# EAGLE design AntHab-Micro-12i (EAGLE 9.6.1)
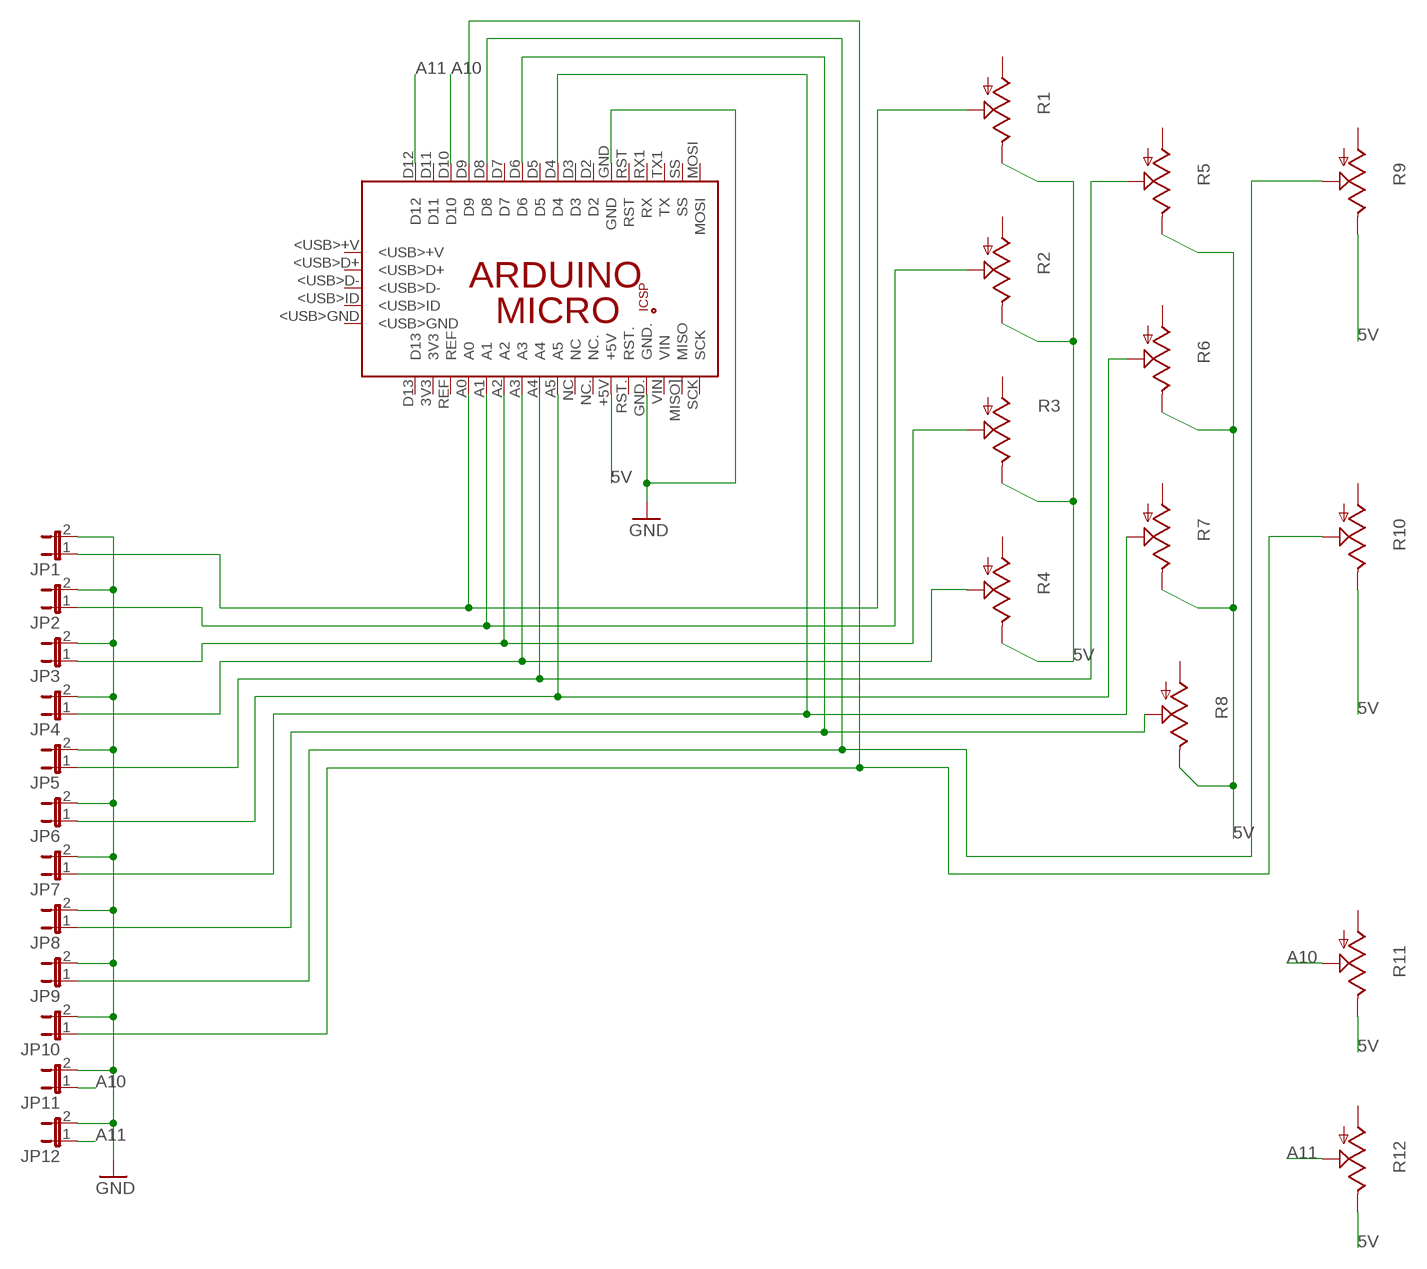
[diagram p0: schematic, sheet 1]

## Parts
JP1  JP1E  [JP1]
JP2  JP1E  [JP1]
JP3  JP1E  [JP1]
JP4  JP1E  [JP1]
JP5  JP1E  [JP1]
JP6  JP1E  [JP1]
JP7  JP1E  [JP1]
JP8  JP1E  [JP1]
JP9  JP1E  [JP1]
JP10  JP1E  [JP1]
JP11  JP1E  [JP1]
JP12  JP1E  [JP1]
PCB1  ARDUINO_MICRO  [ARDUINO_MICRO]
R1  TRIM_US-CT6  [CT6]
R2  TRIM_US-CT6  [CT6]
R3  TRIM_US-CT6  [CT6]
R4  TRIM_US-CT6  [CT6]
R5  TRIM_US-CT6  [CT6]
R6  TRIM_US-CT6  [CT6]
R7  TRIM_US-CT6  [CT6]
R8  TRIM_US-CT6  [CT6]
R9  TRIM_US-CT6  [CT6]
R10  TRIM_US-CT6  [CT6]
R11  TRIM_US-CT6  [CT6]
R12  TRIM_US-CT6  [CT6]

## Nets
5V: PCB1.+5V R1.E R2.E R3.E R4.E R5.E R6.E R7.E R8.E R9.E R10.E R11.E R12.E
A10: JP11.1 PCB1.D10 R11.S
A11: JP12.1 PCB1.D12 R12.S
GND: JP1.2 JP2.2 JP3.2 JP4.2 JP5.2 JP6.2 JP7.2 JP8.2 JP9.2 JP10.2 JP11.2 JP12.2 PCB1.GND PCB1.GND.
N$1: JP4.1 PCB1.A3 R4.S
N$2: JP5.1 PCB1.A4 R5.S
N$3: JP6.1 PCB1.A5 R6.S
N$4: JP7.1 PCB1.D4 R7.S
N$5: JP8.1 PCB1.D6 R8.S
N$6: JP9.1 PCB1.D8 R9.S
N$7: JP10.1 PCB1.D9 R10.S
N$9: JP1.1 PCB1.A0 R1.S
N$10: JP2.1 PCB1.A1 R2.S
N$11: JP3.1 PCB1.A2 R3.S
Unconnected: PCB1.3V3 PCB1.5V PCB1.<USB>+V PCB1.<USB>D+ PCB1.<USB>D- PCB1.<USB>GND PCB1.<USB>ID PCB1.D2 PCB1.D3 PCB1.D5 PCB1.D7 PCB1.D11 PCB1.D13 PCB1.GND_ PCB1.MISO. PCB1.MISO](MISO) PCB1.MOSI PCB1.MOSI. PCB1.NC PCB1.NC. PCB1.REF PCB1.RESET.. PCB1.RST PCB1.RST. PCB1.RX1(RX) PCB1.SCK PCB1.SCK. PCB1.SS PCB1.TX1(TX) PCB1.VIN R1.A R2.A R3.A R4.A R5.A R6.A R7.A R8.A R9.A R10.A R11.A R12.A

## Library data of the parts
JP1-JP12 = jumper:JP1E: JUMPER
PCB1 = E14_Arduino_revC:ARDUINO_MICRO: Device for representing an Arduino Micro board with a footprint in an EAGLE design. Created by Dave Young for Element14. More EAGLE documentation at: http://www.element14.com/community/community/knode/cadsoft_eagle
R1-R12 = pot:TRIM_US-: POTENTIOMETER

## Board
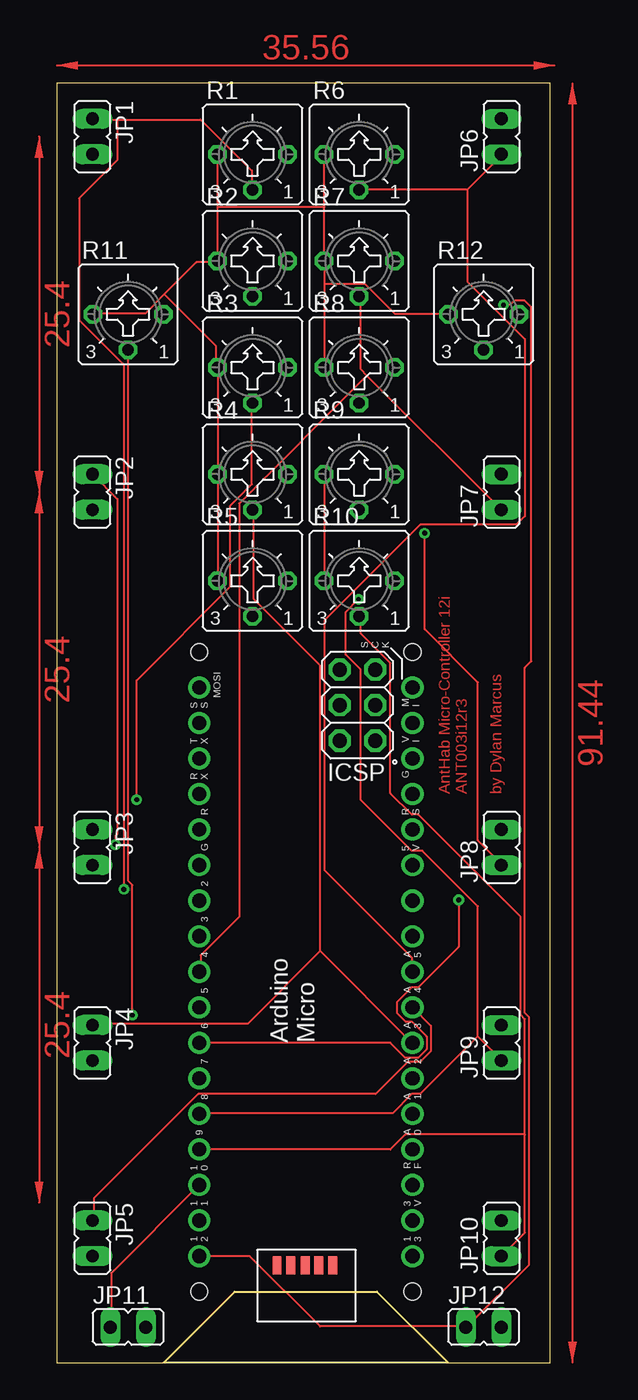
[diagram p1: board, top side]
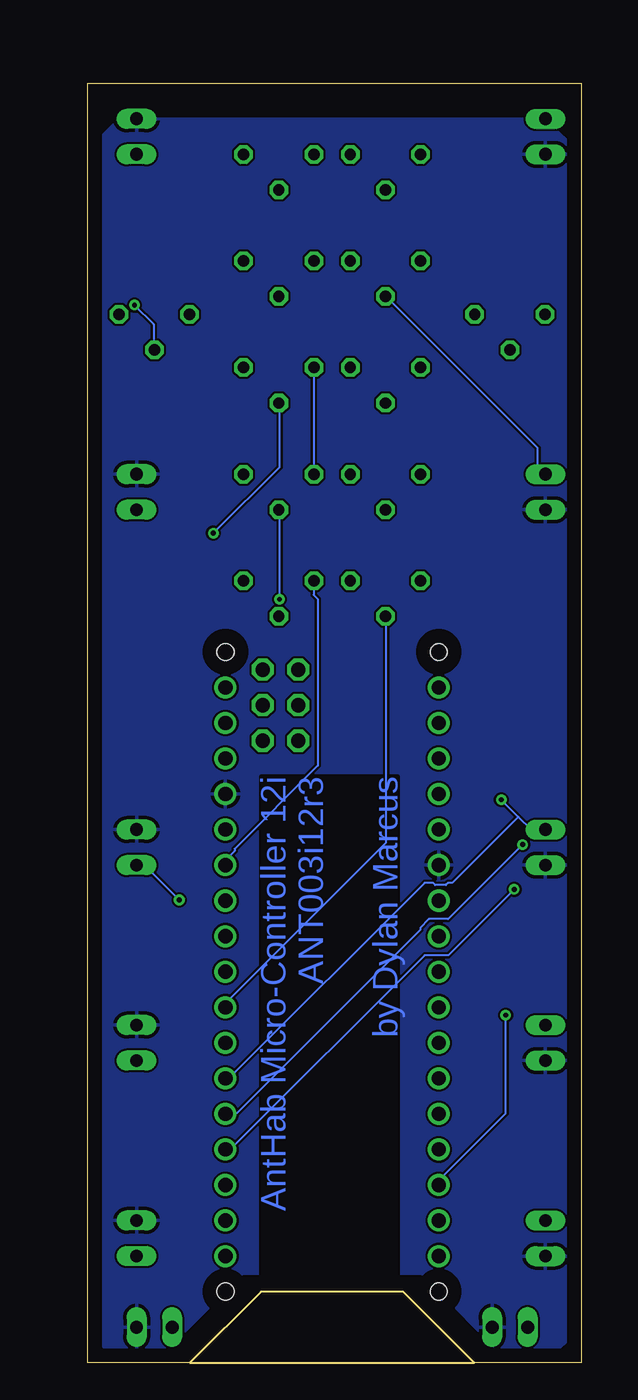
[diagram p2: board, bottom side, seen from below]

Size 35.23 x 91.43 mm. Coordinates in mm from the lower left corner, seen from the top.
Outline: 0,0 35.23,0 35.23,91.43 0,91.43 0,0
Copper layers (1*16): Top 0.035mm / dielectric 1.5mm / Bottom 0.035mm
Design rules "default": minimum track width 6mil, minimum drill 0.35mm, track to track 6mil, track to pad 6mil, pad to pad 6mil, via to via 6mil, smd to smd 6mil, copper to edge 40mil, drill to drill 6mil, minimum pad ring 10mil, minimum via ring 8mil, stop-mask expansion 4mil, vias tented up to drill 0mil, thermal gap 10mil
Milling: 4 lines

### Footprints (pad centres in the part's own frame; a part is rotated, then mirrored left to right if it is on the bottom)
JP1 = drill 0.914 long: 1 0,-1.27; 2 0,1.27
ARDUINO_MICRO = drill 1.016 pad 1.575: 3V3 6.35,1.27; +5V 31.75,1.27; A0 11.43,1.27; A1 13.97,1.27; A2 16.51,1.27; A3 19.05,1.27; A4 21.59,1.27; A5 24.13,1.27; D2 29.21,16.51; D3 26.67,16.51; D4 24.13,16.51; D5 21.59,16.51; D6 19.05,16.51; D7 16.51,16.51; D8 13.97,16.51; D9 11.43,16.51; D10 8.89,16.51; D11 6.35,16.51; D12 3.81,16.51; D13 3.81,1.27; GND 31.75,16.51; GND. 36.83,1.27; MISO] 41.91,1.27; MOSI 44.45,16.51; NC 26.67,1.27; NC. 29.21,1.27; REF 8.89,1.27; RST 34.29,16.51; RST. 34.29,1.27; RX1 36.83,16.51; SCK 44.45,1.27; SS 41.91,16.51; TX1 39.37,16.51; VIN 39.37,1.27 | drill 1.016 pad 1.575 octagon: 5V 40.64,6.477; GND_ 45.72,6.477; MISO. 40.64,3.937; MOSI. 43.18,6.477; RESET.. 45.72,3.937; SCK. 43.18,3.937 | smd 1.27 x 0.635: <USB>+V 3.15,10.947; <USB>D+ 3.15,9.957; <USB>D- 3.15,8.941; <USB>GND 3.15,6.96; <USB>ID 3.15,7.976 | hole 1.2: 1.27,1.27; 1.27,16.51; 46.99,16.51; 46.99,1.27
CT6 = drill 0.813 octagon: A 2.515,0; E -2.515,0; S 0,-2.54

### Placement (x,y rotation side)
JP1  2.54,87.63 180 top
JP2  2.54,62.23 180 top
JP3  2.54,36.83 180 top
JP4  2.54,22.86 180 top
JP5  2.54,8.89 180 top
JP6  31.75,87.63 0 top
JP7  31.75,62.23 0 top
JP8  31.75,36.83 0 top
JP9  31.75,22.86 0 top
JP10  31.75,8.89 0 top
JP11  5.08,2.54 270 top
JP12  30.48,2.54 270 top
PCB1  26.67,3.81 90 top
R1  13.97,86.36 0 top
R2  13.97,78.74 0 top
R3  13.97,71.12 0 top
R4  13.97,63.5 0 top
R5  13.97,55.88 0 top
R6  21.59,86.36 0 top
R7  21.59,78.74 0 top
R8  21.59,71.12 0 top
R9  21.59,63.5 0 top
R10  21.59,55.88 0 top
R11  5.08,74.93 0 top
R12  30.48,74.93 0 top

### Tracks (layer width: path | path; a pad name or v marks a point on that pad's centre or on a via)
5V
  Top 0.152: R10.E 19.1,55.93 19.1,63.4 R9.E | 19.1,77.11 19.1,78.64 R7.E 19.1,78.79 19.1,82.6 | 19.1,77.11 19.1,71.17 R8.E | 19.1,77.11 22,77.11 24.13,74.98 27.94,74.98 R12.E | 19.1,82.6 19.1,86.26 R6.E | R5.E 11.48,55.93 11.48,63.4 R4.E 11.48,63.55 11.48,71.02 R3.E 11.33,71.17 11.33,72.69 7.67,76.35 | 7.67,76.35 9.96,78.64 11.33,78.64 R2.E 11.48,78.79 11.48,82.6 | 7.67,76.35 6.3,74.98 2.64,74.98 R11.E | 11.48,82.6 11.48,86.26 R1.E | 11.48,82.6 19.1,82.6
  Bottom 0.152: PCB1.+5V 25.35,35.66 25.35,35.97 24.74,36.58 24.74,36.73 18.8,42.67 18.8,54.56 19.1,54.86 19.1,55.78 R10.E | R9.E 19.1,63.55 19.1,71.02 R8.E
A10  (via drill 0.35)
  Top 0.152: R11.S 5.08,34.44 5.38,34.14 v5.38,24.84 | PCB1.D10 3.86,6.4 3.86,2.59 JP11.1
  Bottom 0.152: v5.38,24.84 5.38,17.83 10.11,13.11 10.11,12.8 PCB1.D10
A11  (via drill 0.35)
  Top 0.152: v31.9,75.59 32.36,75.59 32.66,75.89 33.43,75.89 33.88,75.44 33.88,50.14 33.43,49.68 33.43,24.99 33.73,24.69 33.73,7.01 29.31,2.59 JP12.1 29.16,2.59 18.8,2.59 13.77,7.62 PCB1.D12
  Bottom 0.152: v31.9,75.59 30.53,74.22 30.53,72.39 R12.S
GND
  pour Bottom: 0,2.54 0,86.36 2.54,88.9 33.02,88.9 35.56,86.36 35.56,2.54 33.02,0 30.48,0 24.13,6.35 11.43,6.35 5.08,0 2.54,0
N$1
  Top 0.152: 18.8,29.41 18.8,49.84 14.07,54.56 14.07,60.96 R4.S | 18.8,29.41 25.35,22.86 PCB1.A3 | 18.8,29.41 13.61,24.23 2.64,24.23 JP4.1
N$2
  Top 0.152: PCB1.A4 26.72,24.08 26.72,22.25 25.96,21.49 25.04,21.49 22.76,19.2 10.11,19.2 2.64,11.73 2.64,10.21 JP5.1
  Bottom 0.152: R5.S 13.92,53.34 13.92,37.19 25.35,25.76 25.35,25.45 PCB1.A4
N$3
  Top 0.152: 29.31,83.82 R6.S | 29.31,83.82 31.75,86.26 JP6.1 | 29.31,83.82 29.31,77.27 33.43,73.15 33.43,60.5 32.82,59.89 25.96,59.89 19.1,53.03 19.1,35.2 25.35,28.96 25.35,28.04 PCB1.A5
N$4
  Top 0.152: JP7.1 22.15,70.56 | 22.15,70.56 21.69,71.02 21.69,76.2 R7.S | 22.15,70.56 13.01,61.42 13.01,31.85 10.26,29.11 10.26,28.04 PCB1.D4
N$5  (via drill 0.35)
  Top 0.152: v26.26,59.28 26.26,52.43 30.07,48.62 30.07,37.34 31.75,35.66 JP8.1 | PCB1.D6 23.83,22.86 24.89,21.79 25.81,21.79 26.42,22.4 26.42,23.32 25.35,24.38 24.89,24.38 24.28,24.99 24.28,25.76 25.35,26.82 25.81,26.82 28.7,29.72 v28.7,33.07
  Bottom 0.152: v26.26,59.28 21.54,64.01 21.54,68.58 R8.S | v28.7,33.07 31.14,35.51 31.75,35.51 JP8.1
N$6  (via drill 0.35)
  Top 0.152: v21.54,54.56 20.62,53.64 20.62,50.6 21.69,49.53 21.69,40.23 25.35,36.58 26.11,36.58 30.07,32.61 30.07,23.32 | 30.07,23.32 31.75,21.64 JP9.1 | 30.07,23.32 25.96,19.2 25.35,19.2 23.98,17.83 10.26,17.83 PCB1.D8
  Bottom 0.152: v21.54,54.56 21.54,60.96 R9.S
N$7
  Top 0.152: 33.43,16.31 33.43,9.3 JP10.1 | 33.43,16.31 33.43,24.54 33.12,24.84 33.12,31.85 25.81,39.17 25.35,39.17 23.83,40.69 23.83,49.99 21.69,52.12 21.69,53.34 R10.S | PCB1.D9 23.83,15.24 24.89,16.31 33.43,16.31
N$9  (via drill 0.35)
  Top 0.152: 4.32,88.85 2.64,88.85 JP1.1 | 4.32,88.85 10.26,88.85 13.92,85.19 13.92,83.82 R1.S | v4.78,33.83 4.78,71.32 1.58,74.52 1.58,83.21 4.32,85.95 4.32,88.85
  Bottom 0.152: PCB1.A0 25.04,15.24 11.18,29.11 9.5,29.11 v4.78,33.83
N$10  (via drill 0.35)
  Top 0.152: v4.17,37.03 4.17,37.64 4.32,37.79 4.32,61.72 JP2.1
  Bottom 0.152: R2.S 13.92,76.2 3.1,65.38 3.1,64.01 2.64,63.55 JP2.1 | v4.17,37.03 9.5,31.7 10.87,31.7 11.48,31.09 11.48,30.94 24.59,17.83 25.35,17.83 PCB1.A1
N$11  (via drill 0.35)
  Top 0.152: v5.69,40.23 5.69,48.77 12.4,55.47 12.4,61.27 13.92,62.79 13.92,68.58 R3.S
  Bottom 0.152: 4.47,39.01 3.56,38.1 JP3.1 | 4.47,39.01 v5.69,40.23 | 4.47,39.01 9.2,34.29 9.5,34.29 9.65,34.14 10.41,34.14 10.57,34.29 11.18,34.29 25.04,20.42 25.35,20.42 PCB1.A2
(copper drawn outside any net)
  shapes: Top area x5

### Text on the board
Top: AntHab Micro-Controller 12i / ANT003i12r3 / / by Dylan Marcus
Bottom: AntHab Micro-Controller 12i / ANT003i12r3 / / by Dylan Marcus